# Altium schematic sheet Sheet1.SchDoc
size A; SheetNumber: 1; SheetTotal: 1
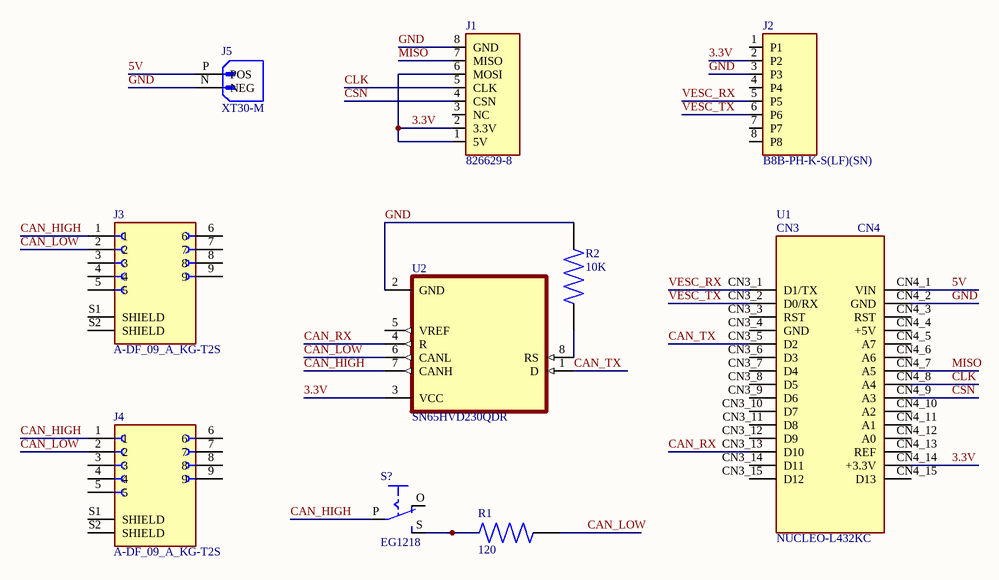
[diagram p0: Sheet1.SchDoc]

## Parts
J1  826629-8  [TE_826629-8]
J2  B8B-PH-K-S(LF)(SN)  [JST_B8B-PH-K-S(LF)(SN)]
J3  A-DF_09_A_KG-T2S  [ASSMANN_A-DF_09_A_KG-T2S]
J4  A-DF_09_A_KG-T2S  [ASSMANN_A-DF_09_A_KG-T2S]
J5  XT30-M  [AMASS_XT60-M]
R1  120  [RESC3216X65N]
R2  10K  [RESC3216X65N]
S?  EG1218  [EG1218]
U1  NUCLEO-L432KC  [MODULE_NUCLEO-L432KC]
U2  SN65HVD230QDR  [SOIC127P599X175-8N]

## Nets
3.3V: J1.1(5V) J1.2(3.3V) J1.6(MOSI) J2.2(P2) U1.CN4_14(+3.3V) U2.3(VCC)
5V: J5.P(POS) U1.CN4_1(VIN)
CAN_HIGH: J3.1 J4.1 S?.P U2.7(CANH)
CAN_LOW: J3.2 J4.2 R1.2 U2.6(CANL)
CAN_RX: U1.CN3_13(D10) U2.4(R)
CAN_TX: U1.CN3_5(D2) U2.1(D)
CLK: J1.5(CLK) U1.CN4_8(A4)
CSN: J1.4(CSN) U1.CN4_9(A3)
GND: J1.8(GND) J2.3(P3) J5.N(NEG) R2.2 U1.CN4_2(GND) U2.2(GND)
MISO: J1.7(MISO) U1.CN4_7(A5)
VESC_RX: J2.5(P5) U1.CN3_1(D1/TX)
VESC_TX: J2.6(P6) U1.CN3_2(D0/RX)
NetR1_1: R1.1 S?.S
NetR2_1: R2.1 U2.8(RS)

Not connected (* = marked no-connect by the designer): J1 3(NC); J2 1(P1) 4(P4) 7(P7) 8(P8); J3 3 4 5 6 7 8 9 S1(SHIELD) S2(SHIELD); J4 3 4 5 6 7 8 9 S1(SHIELD) S2(SHIELD); S? O; U1 CN3_3(RST) CN3_4(GND) CN3_6(D3) CN3_7(D4) CN3_8(D5) CN3_9(D6) CN3_10(D7) CN3_11(D8) CN3_12(D9) CN3_14(D11) CN3_15(D12) CN4_3(RST) CN4_4(+5V) CN4_5(A7) CN4_6(A6) CN4_10(A2) CN4_11(A1) CN4_12(A0) CN4_13(REF) CN4_15(D13); U2 5(VREF)

## Notes on the sheet
- (in symbol NUCLEO-L432KC) CN3; CN4

## Library data of the parts
J1 = 826629-8: Conn Unshrouded Header HDR 8 POS 2.54mm Solder ST Thru-Hole Automotive Box; MF: TE Connectivity; EU_RoHS_Compliance: Compliant; TE_purchase_URL: https://www.te.com/usa-en/product-826629-8.html?te_bu=Cor&te_type=disp&te_campaign=seda_glo_cor-seda-global-disp-prtnr-fy19-seda-model-bom-cta_sma-317_1&elqCampaignId=32493; MP: 826629-8; Value: *; Availability: Unavailable; SnapEDA_Link: https://www.snapeda.com/parts/826629-8/TE%20Connectivity%20AMP%20Connectors/view-part/456641/?ref=snap; Price: None; Package: None
J2 = B8B-PH-K-S(LF)(SN): Connector Header Through Hole 8 position 0.079 _2.00mm_; MF: JST Sales; MP: B8B-PH-K-S_LF__SN_; SnapEDA_Link: https://www.snapeda.com/parts/B8B-PH-K-S%28LF%29%28SN%29/JST%20Sales%20America%20Inc./view-part/424392/?ref=snap; Value: *; Package: None
J3 J4 = A-DF_09_A_KG-T2S: 9 Position D-Sub Receptacle, Female Sockets Connector; MF: Assmann WSW; MP: A-DF 09 A/KG-T2S; Value: *; Purchase-URL: https://pricing.snapeda.com/search/part/A-DF 09 A/KG-T2S/?ref=eda; Package: None; Check_prices: https://www.snapeda.com/parts/A-DF%2009%20A/KG-T2S/Assmann+WSW+Components/view-part/?ref=eda; Price: None; SnapEDA_Link: https://www.snapeda.com/parts/A-DF%2009%20A/KG-T2S/Assmann+WSW+Components/view-part/?ref=snap; Availability: In Stock
J5 = XT30-M: Plug; DC supply; XT60; male; PIN: 2; for cable; soldered; 30A; 500V; MP: XT60-M; MF: AMASS; Package: Package; Availability: Not in stock; SnapEDA_Link: https://www.snapeda.com/parts/XT60-M/AMASS/view-part/?ref=snap; Check_prices: https://www.snapeda.com/parts/XT60-M/AMASS/view-part/?ref=eda; Price: None; Value: *
R1 R2 = KTR18EZPF9530: Package: None; Price: None; Value: *; MP: KTR18EZPF9530; Availability: Unavailable
S? = EG1218: <b>SLIDING SWITCH</b><p> 0.1" spacing through hole, vertical SPDT slide switch <p>http://www.ladyada.net/library/pcb/eaglelibrary.html</p>; Package: None; Availability: Unavailable; Value: *; MP: EG1218; Price: None
U1 = NUCLEO-L432KC: STM32 Nucleo-32 development board with STM32L432KC MCU, supports Arduino connectivity; Package: None; Price: None; Availability: Unavailable; MP: NUCLEO-L432KC; Value: *
U2 = SN65HVD230QDR: 3.3-V CAN Transceiver with Standby Mode 8-SOIC -40 to 125; MF: Texas Instruments; Package: SOIC-8 Texas Instruments; Price: None; MP: SN65HVD230QDR; Availability: Good; Value: *; Check_prices: https://www.snapeda.com/parts/SN65HVD230QDR/Texas%20Instruments/view-part/1178075/?ref=eda; Purchase-URL: https://pricing.snapeda.com/search/part/SN65HVD230QDR/?ref=eda; SnapEDA_Link: https://www.snapeda.com/parts/SN65HVD230QDR/Texas%20Instruments/view-part/1178075/?ref=snap